# EasyEDA Pro project NUEVO board Rev. B.epro, schematic Amazon_B074TH1719
Board Name: Amazon_B074TH1719; Create Date: 2025-12-17; Page Name: P1; Project Name: Amazon_B074TH1719; Schematic Name: Amazon_B074TH1719; Update Date: 2025-12-16; Company: EasyEDA.com; Page Size: A4; Version: V1.0
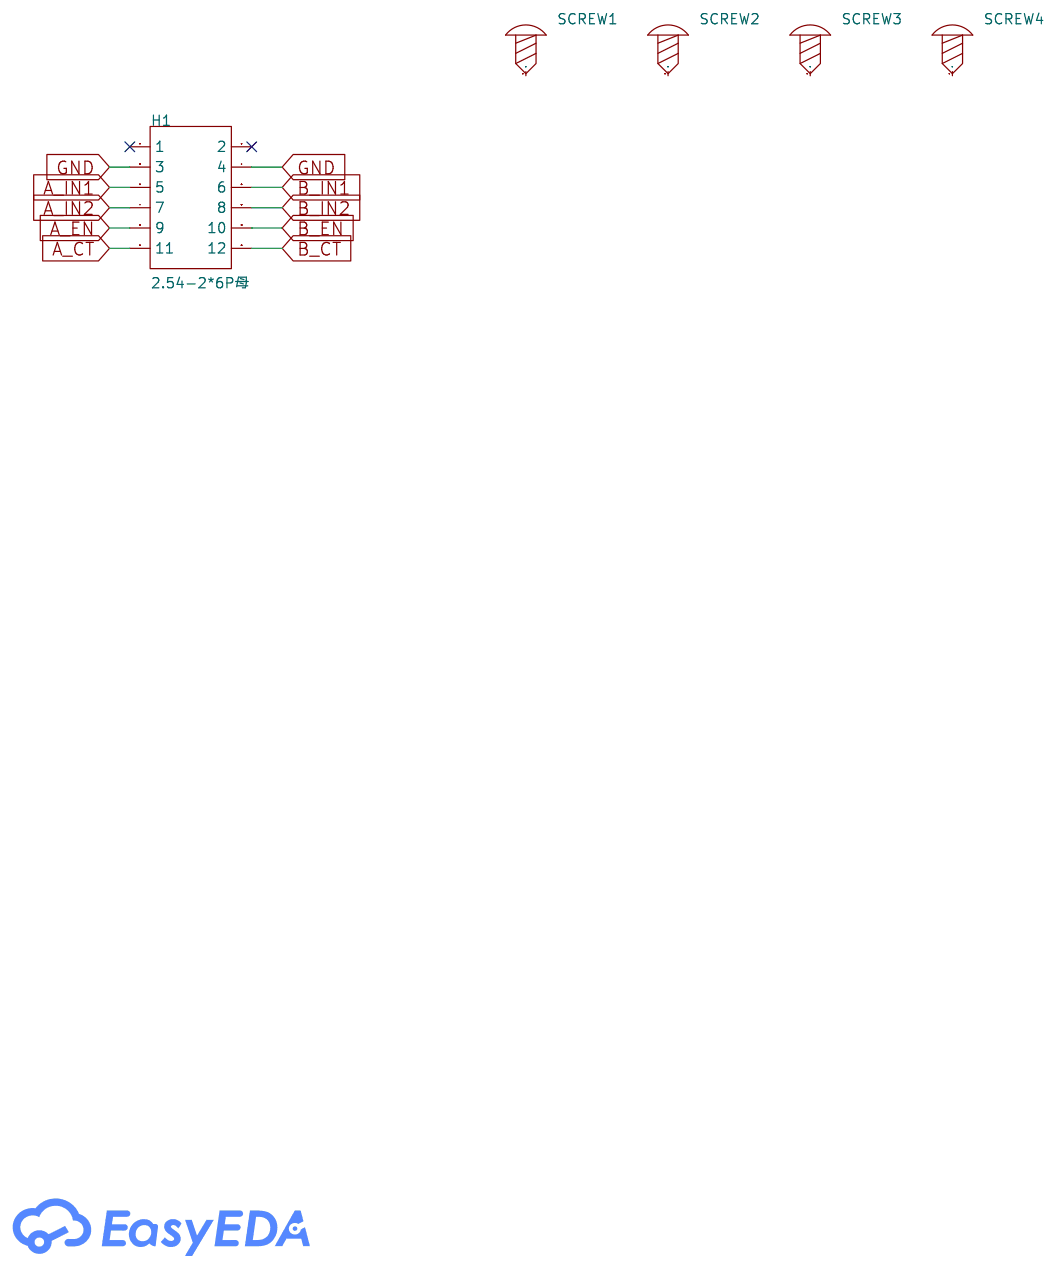
[diagram p0: schematic sheet]

## Parts
H1  2.54-2*6P母  [HDR-TH_12P-P2.54-V-F-R2-C6-S2.54]
SCREW1  -  [Screw-Hole-M2]
SCREW2  -  [Screw-Hole-M2]
SCREW3  -  [Screw-Hole-M2]
SCREW4  -  [Screw-Hole-M2]

## Library data of the parts
H1 = 2.54-2*6P母: Holes Structure:2x6P Pitch:2.54mm Row Spacing:2.54mm Circular Hole / Square Hole:Square Hole Mounting Type:Through Hole Number of Rows:2 Number of Positions:12P Holes Direction:Top Insulation Height:- Contact Material:Brass Contact Plating:-; LCSC Part Name: 2x6P 间距:2.54mm 直插; Supplier Part: C36191; Manufacturer: BOOMELE(博穆精密); Supplier Footprint: 插件,P=2.54mm; Supplier: LCSC; Holes Structure: 2x6P; Pitch: 2.54mm; Row Spacing: 2.54mm; Circular Hole / Square Hole: Square Hole; Mounting Type: Through Hole; Number of Rows: 2; Number of Positions: 12P; Holes Direction: Top; Contact Material: Brass
SCREW1-SCREW4 = Screw-Hole-M2: Supplier Footprint: 插件

## Nets
GND: H1.3 H1.4
A_CT: H1.11
A_EN: H1.9
A_IN1: H1.5
A_IN2: H1.7
B_CT: H1.12
B_EN: H1.10
B_IN1: H1.6
B_IN2: H1.8

Not connected (* = marked no-connect by the designer): H1 1* 2*; SCREW1 1; SCREW2 1; SCREW3 1; SCREW4 1
